# Altium schematic sheet [10]-MODEM_CONNECTORS.SchDoc
size A4
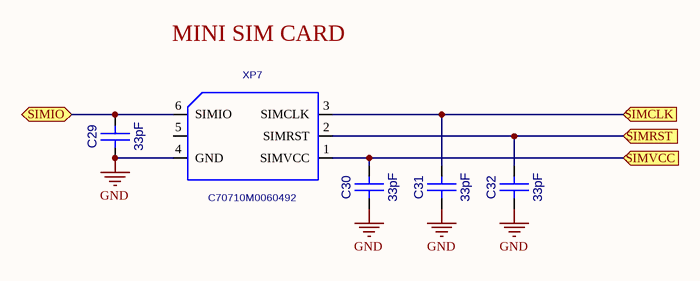
[diagram p0: [10]-MODEM_CONNECTORS.SchDoc]

## Parts
C29  33pF  [CC0603]
C30  33pF  [CC0603]
C31  33pF  [CC0603]
C32  33pF  [CC0603]
XP7  C70710M0060492  [SCVW06A25020]

## Ports
SIMCLK (in), SIMIO (bidir), SIMRST (in), SIMVCC (in)

## Nets
GND: C29.1(A) C30.1(A) C31.1(A) C32.1(A) XP7.4(GND)
SIMCLK: C31.2(B) XP7.3(SIMCLK) ; port SIMCLK
SIMIO: C29.2(B) XP7.6(SIMIO) ; port SIMIO
SIMRST: C32.2(B) XP7.2(SIMRST) ; port SIMRST
SIMVCC: C30.2(B) XP7.1(SIMVCC) ; port SIMVCC

Not connected (* = marked no-connect by the designer): XP7 5

## Notes on the sheet
- MINI SIM CARD

## Library data of the parts
C29-C32 = CC0603: Value: 33pF
XP7 = SCV-W06A25-020: Value: *